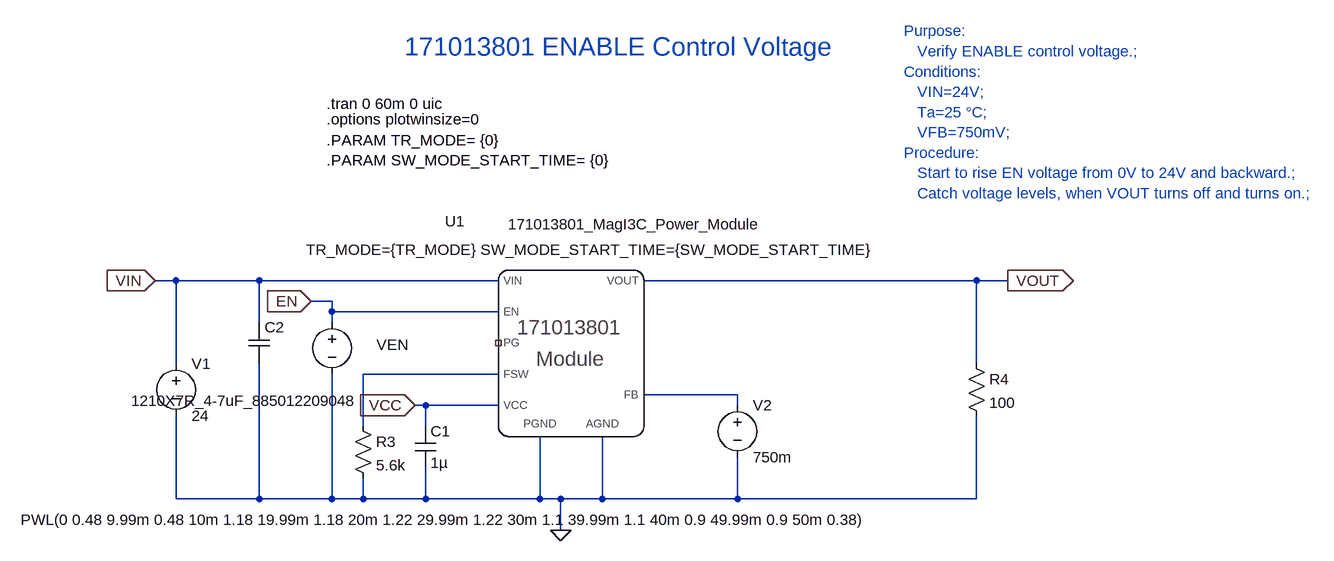
[diagram p0: schematic 171013801 ENABLE Control Voltage.asc]
171013801 ENABLE Control Voltage.asc, the LTspice schematic file:
Version 4
SHEET 1 1600 680
WIRE -384 48 -416 48
WIRE -256 48 -384 48
WIRE 112 48 -256 48
WIRE 848 48 336 48
WIRE 896 48 848 48
WIRE -144 80 -176 80
WIRE -144 96 -144 80
WIRE 112 96 -144 96
WIRE -256 112 -256 48
WIRE -144 112 -144 96
WIRE -384 176 -384 48
WIRE 848 176 848 48
WIRE 112 192 -96 192
WIRE 480 224 336 224
WIRE 0 240 -16 240
WIRE 112 240 0 240
WIRE 480 240 480 224
WIRE -96 272 -96 192
WIRE 0 272 0 240
WIRE -384 384 -384 256
WIRE -256 384 -256 176
WIRE -256 384 -384 384
WIRE -144 384 -144 192
WIRE -144 384 -256 384
WIRE -96 384 -96 352
WIRE -96 384 -144 384
WIRE 0 384 0 336
WIRE 0 384 -96 384
WIRE 176 384 176 288
WIRE 176 384 0 384
WIRE 208 384 176 384
WIRE 272 384 272 288
WIRE 272 384 208 384
WIRE 480 384 480 320
WIRE 480 384 272 384
WIRE 848 384 848 256
WIRE 848 384 480 384
WIRE 208 432 208 384
FLAG 208 432 0
FLAG -416 48 VIN
IOPIN -416 48 In
FLAG 896 48 VOUT
IOPIN 896 48 Out
FLAG -176 80 EN
IOPIN -176 80 In
FLAG -16 240 VCC
IOPIN -16 240 In
SYMBOL res -112 256 R0
SYMATTR InstName R3
SYMATTR Value 5.6k
SYMBOL cap -16 272 R0
SYMATTR InstName C1
SYMATTR Value 1µ
SYMATTR SpiceLine Rser=7.13m Lser=257p
SYMBOL res 832 160 R0
SYMATTR InstName R4
SYMATTR Value 100
SYMBOL voltage 480 224 R0
WINDOW 123 0 0 Left 0
WINDOW 39 0 0 Left 0
SYMATTR InstName V2
SYMATTR Value 750m
SYMBOL voltage -144 96 R0
WINDOW 123 0 0 Left 0
WINDOW 39 24 124 Left 2
WINDOW 0 117 51 Right 2
WINDOW 3 838 320 Right 2
SYMATTR InstName VEN
SYMATTR Value PWL(0 0.48 9.99m 0.48 10m 1.18 19.99m 1.18 20m 1.22 29.99m 1.22 30m 1.1 39.99m 1.1 40m 0.9 49.99m 0.9 50m 0.38)
SYMBOL voltage -384 160 R0
WINDOW 123 0 0 Left 0
WINDOW 39 0 0 Left 0
SYMATTR InstName V1
SYMATTR Value 24
SYMBOL WCAP-CSGP_50V_DCbias -272 112 R0
WINDOW 38 -181 121 Left 2
SYMATTR SpiceModel 1210X7R_4-7uF_885012209048
SYMATTR InstName C2
SYMBOL 171013801_MagI3C_Power_Module 256 64 R0
SYMATTR InstName U1
TEXT -32 -312 Left 4 ;171013801 ENABLE Control Voltage
TEXT 736 -336 Left 2 ;Purpose: \n   Verify ENABLE control voltage.; \nConditions: \n   VIN=24V;  \n   Ta=25 °C; \n   VFB=750mV;  \nProcedure: \n   Start to rise EN voltage from 0V to 24V and backward.; \n   Catch voltage levels, when VOUT turns off and turns on.;
TEXT -152 -224 Left 2 !.tran 0 60m 0 uic
TEXT -152 -200 Left 2 !.options plotwinsize=0
TEXT -152 -168 Left 2 !.PARAM TR_MODE= {0}\n.PARAM SW_MODE_START_TIME= {0}

The netlist it stands for:
* 171013801 ENABLE Control Voltage.asc
R3 N001 0 5.6k
C1 VCC 0 1µ Rser=7.13m Lser=257p
R4 VOUT 0 100
V2 N002 0 750m
VEN EN 0 PWL(0 0.48 9.99m 0.48 10m 1.18 19.99m 1.18 20m 1.22 29.99m 1.22 30m 1.1 39.99m 1.1 40m 0.9 49.99m 0.9 50m 0.38)
V1 VIN 0 24
XC2 VIN 0 1210X7R_4-7uF_885012209048  ; pins A B
XU1 VOUT N002 VIN EN NC_01 N001 VCC 0 0 171013801_MagI3C_Power_Module TR_MODE={TR_MODE} SW_MODE_START_TIME={SW_MODE_START_TIME}  ; pins VOUT FB VIN EN PG FSW VCC PGND AGND
* 171013801 ENABLE Control Voltage
* Purpose:
*    Verify ENABLE control voltage.;
* Conditions:
*    VIN=24V;
*    Ta=25 °C;
*    VFB=750mV;
* Procedure:
*    Start to rise EN voltage from 0V to 24V and backward.;
*    Catch voltage levels, when VOUT turns off and turns on.;
.tran 0 60m 0 uic
.options plotwinsize=0
.PARAM TR_MODE= {0}
.PARAM SW_MODE_START_TIME= {0}
.lib WCAP-CSGP_50V_DCbias.lib
.lib 171013801.lib
.backanno
.end